# Altium schematic sheet Sch_Dr_SBUS .SchDoc
size A4 portrait; Author: Noname; Organization: Spec Company; Address3: ULY; Revision: Ver.1.0
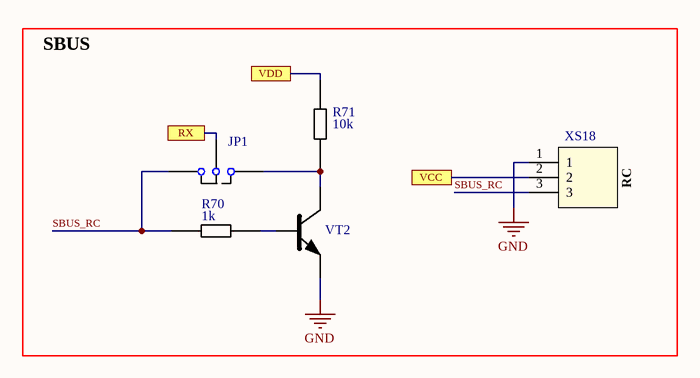
[diagram p0: Sch_Dr_SBUS .SchDoc]

## Parts
JP1  Jumper  [Jumper]  (value not drawn)
R70  1k  [Res_0603]
R71  10k  [Res_0603]
VT2  MMBT3904  [SOT-23-3]  (value not drawn)
XS18  PLS-3  [3X]  (value not drawn)

## Ports
RX, VCC, VDD

## Nets
GND: VT2.2(E) XS18.1
RX: JP1.2 ; port RX
SBUS_RC: JP1.3 R70.1 XS18.3
VCC: XS18.2 ; port VCC
VDD: R71.1 ; port VDD
NetJP1_1: JP1.1 R71.2 VT2.3(C)
NetR70_2: R70.2 VT2.1(B)

## Notes on the sheet
- SBUS
- RC
- Title
- Size:
- Date:
- A4
- Number:
- Time:
- Revision:
- Sheet
- of
- File:

## Library data of the parts
R70 = Res_: CR-03FL7----1K
R71 = Res_: CR-03FL7---10K
VT2 = MMBT3904: SOT-23, -40V, -0.2A, PNP Bipolar Transistor